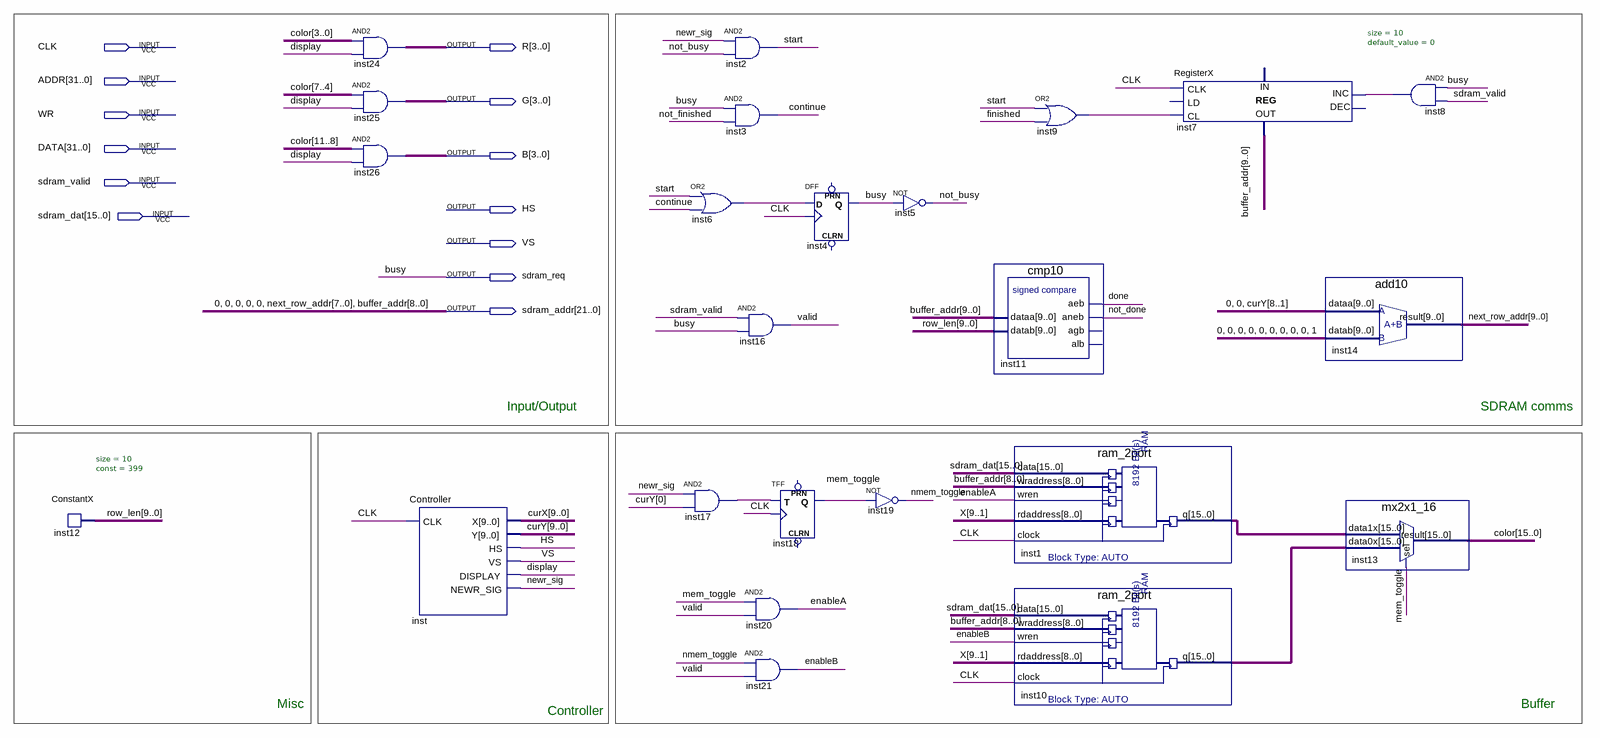
[diagram p0: schematic sheet]
// Quartus schematic GPU.bdf as structural Verilog: 24 symbols, 13 pins
module GPU (
  input  CLK,
  input  [31:0] ADDR,
  input  WR,
  input  [31:0] DATA,
  input  sdram_valid,
  input  [15:0] sdram_dat,
  output [3:0] R,
  output [3:0] G,
  output [3:0] B,
  output HS,
  output VS,
  output sdram_req,
  output [21:0] sdram_addr
);

  wire \1 , \continue , display, done, enableA, enableB, finished, inst6_out, inst8_out, inst9_out,
       inst17_out, mem_toggle, newr_sig, nmem_toggle, not_busy, not_done, not_finished, start, valid;
  wire [9:0] curX, curY, row_len;
  wire [9:1] X;
  wire [9:8] next_row_addr;
  wire [9:9] buffer_addr;
  wire [15:0] color, inst1_q, inst10_q;

  ConstantX #(.size(10), .\const (399)) inst12 (.DATA_OUT(row_len));
  assign R = color[3:0] & {4{display}};  // AND2 inst24, 4 bits wide
  assign G = color[7:4] & {4{display}};  // AND2 inst25, 4 bits wide
  assign B = color[11:8] & {4{display}};  // AND2 inst26, 4 bits wide
  Controller inst (.CLK(CLK), .X(curX), .Y(curY), .HS(HS), .VS(VS), .DISPLAY(display), .NEWR_SIG(newr_sig));
  and inst2 (start, newr_sig, not_busy);
  and inst3 (\continue , sdram_req, not_finished);
  or inst6 (inst6_out, start, \continue );
  and inst17 (inst17_out, newr_sig, curY[0]);
  and inst16 (valid, sdram_valid, sdram_req);
  TFF inst18 (.T(inst17_out), .CLK(CLK), .Q(mem_toggle));  // open: PRN, CLRN
  and inst20 (enableA, mem_toggle, valid);
  and inst21 (enableB, nmem_toggle, valid);
  DFF inst4 (.CLK(CLK), .D(inst6_out), .Q(sdram_req));  // open: CLRN, PRN
  not inst19 (nmem_toggle, mem_toggle);
  not inst5 (not_busy, sdram_req);
  cmp10 inst11 (
    .dataa({buffer_addr[9], sdram_addr[8:0]}), .datab(row_len), .aeb(done), .aneb(not_done));  // open: agb, alb
  or inst9 (inst9_out, start, finished);
  ram_2port inst1 (
    .data(sdram_dat), .wraddress(sdram_addr[8:0]), .wren(enableA), .rdaddress(X), .clock(CLK), .q(inst1_q));
  ram_2port inst10 (
    .data(sdram_dat), .wraddress(sdram_addr[8:0]), .wren(enableB), .rdaddress(X), .clock(CLK), .q(inst10_q));
  RegisterX #(.size(10), .default_value(0)) inst7 (
    .CLK(CLK), .CL(inst9_out), .INC(inst8_out), .DATA_OUT({buffer_addr[9], sdram_addr[8:0]}));  // open: LD, DEC, DATA_IN
  add10 inst14 (
    .dataa({{2{sdram_addr[21]}}, curY[8:1]}), .datab({{9{sdram_addr[21]}}, \1 }),
    .result({next_row_addr, sdram_addr[16:9]}));
  mx2x1_16 inst13 (.data1x(inst1_q), .data0x(inst10_q), .sel(mem_toggle), .result(color));
  and inst8 (inst8_out, sdram_req, sdram_valid);

  assign sdram_addr[20:17] = {4{sdram_addr[21]}};

  // Other names for the same wires on the sheet: 0 = sdram_addr[21]; buffer_addr[8:0] = sdram_addr[8:0];
  //   busy = sdram_req; next_row_addr[7:0] = sdram_addr[16:9]

  // Notes on the sheet:
  //   Input/Output
  //   SDRAM comms
  //   Misc
  //   Buffer
  //   Controller
endmodule
